# Altium schematic sheet nrf51x22_qfac_dcdc.SchDoc: nRF51x22-QFAC Reference Layout (DCDC)
size A4; Revision: 1.0; SheetNumber: 1; SheetTotal: 1; DrawnBy: RUBR; DocumentSize: A4; PCAName: nRF51x22-QFAC Reference Layout (DCDC)
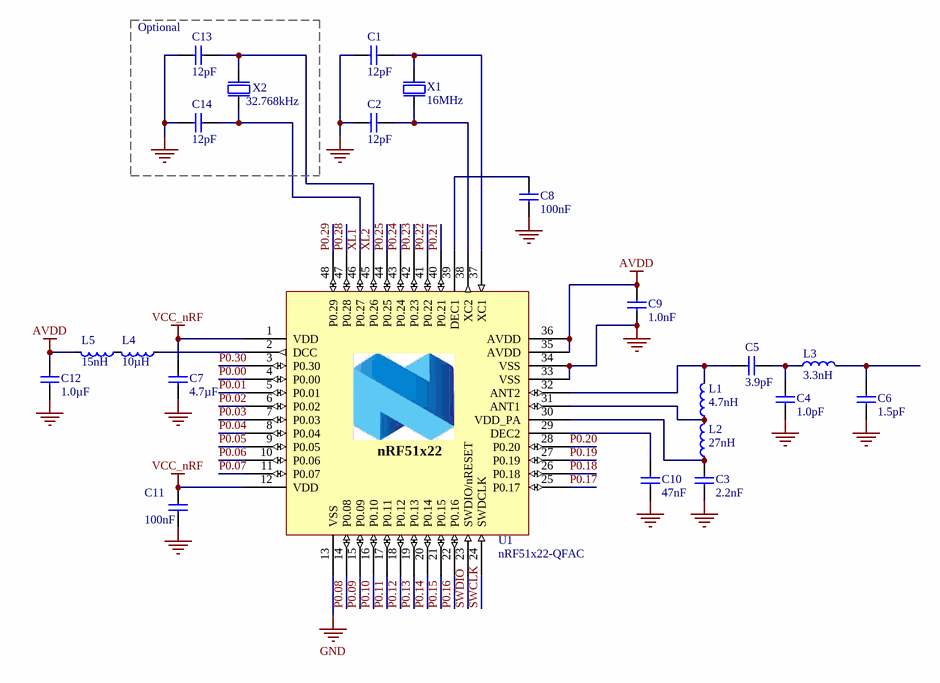
[diagram p0: nrf51x22_qfac_dcdc.SchDoc]

## Parts
C1  12pF  [CAPC1005X04L]
C2  12pF  [CAPC1005X04L]
C3  2.2nF  [CAPC1005X04L]
C4  1.0pF  [CAPC1005X04L]
C5  3.9pF  [CAPC1005X04L]
C6  1.5pF  [CAPC1005X04L]
C7  4.7µF  [CAPC1608X06L]
C8  100nF  [CAPC1005X04L]
C9  1.0nF  [CAPC1005X04L]
C10  47nF  [CAPC1005X04L]
C11  100nF  [CAPC1005X04L]
C12  1.0µF  [CAPC1608X06L]
C13  12pF  [CAPC1005X04L]
C14  12pF  [CAPC1005X04L]
L1  4.7nH  [INDC1005X04L]
L2  27nH  [INDC1005X04L]
L3  3.3nH  [INDC1005X04L]
L4  10µH  [INDC1608X06L]
L5  15nH  [INDC1005X04L]
U1  nRF51x22-QFAC  [QFN40P600X600X90-48N]
X1  16MHz  [BT-XTAL_2520]
X2  32.768kHz  [XTAL_3215]

## Blocks framed on the sheet
Optional: C13 C14 X2

## Nets
AVDD: C9.1 C12.2 L5.2 U1.35(AVDD) U1.36(AVDD)
GND: C1.2 C2.2 C3.2 C4.2 C6.2 C7.2 C8.2 C9.2 C10.2 C11.2 C12.1 C13.1 C14.1 U1.13(VSS) U1.33(VSS) U1.34(VSS) U1.49 X1.2(GND) X1.4(GND)
VCC_nRF: C7.1 C11.1 U1.1(VDD) U1.12(VDD)
P0.00: U1.4(P0.00)
P0.01: U1.5(P0.01)
P0.02: U1.6(P0.02)
P0.03: U1.7(P0.03)
P0.04: U1.8(P0.04)
P0.05: U1.9(P0.05)
P0.06: U1.10(P0.06)
P0.07: U1.11(P0.07)
P0.08: U1.14(P0.08)
P0.09: U1.15(P0.09)
P0.10: U1.16(P0.10)
P0.11: U1.17(P0.11)
P0.12: U1.18(P0.12)
P0.13: U1.19(P0.13)
P0.14: U1.20(P0.14)
P0.15: U1.21(P0.15)
P0.16: U1.22(P0.16)
P0.17: U1.25(P0.17)
P0.18: U1.26(P0.18)
P0.19: U1.27(P0.19)
P0.20: U1.28(P0.20)
P0.21: U1.40(P0.21)
P0.22: U1.41(P0.22)
P0.23: U1.42(P0.23)
P0.24: U1.43(P0.24)
P0.25: U1.44(P0.25)
P0.28: U1.47(P0.28)
P0.29: U1.48(P0.29)
P0.30: U1.3(P0.30)
SWCLK: U1.24(SWDCLK)
SWDIO: U1.23(SWDIO/nRESET)
XL1: C14.2 U1.46(P0.27) X2.2(out)
XL2: C13.2 U1.45(P0.26) X2.1(inp)
NetC1_1: C1.1 U1.37(XC1) X1.1(inp)
NetC2_1: C2.1 U1.38(XC2) X1.3(out)
NetC3_1: C3.1 L2.1 U1.30(VDD_PA)
NetC4_1: C4.1 C5.2 L3.1
NetC5_1: C5.1 L1.2 U1.32(ANT2)
NetC6_1: C6.1 L3.2
NetC8_1: C8.1 U1.39(DEC1)
NetC10_1: C10.1 U1.29(DEC2)
NetL1_1: L1.1 L2.2 U1.31(ANT1)
NetL4_1: L4.1 U1.2(DCC)
NetL4_2: L4.2 L5.1

## Notes on the sheet
- Title
- Size
- Date:
- Project Number
- Sheet         of
- Revision
- File:
- Drawn By:
- (in symbol nRF51x22-QFAC) nRF51x22

## Library data of the parts
C1 C2 C13 C14 = C0402-12p: Capacitor, NP0, ±2%; Note: 50V; Artikkelnr Noca: 20029159; Artikkelnr Simpro: N.A.; Part Number: C0402-12p; Manufacturer: *; Manufacturer Part Number: *; Datasheet: *; LatestRevisionDate: 2011-05-11; Pin Count: 2; Publisher: Nordic Semiconductor; Published: 2009-05-08; Value: 12pF; Supplier: *; Supplier part number: *; 2nd source Supplier: *; 2nd source part number: *; Footprint Doc: 0402
C3 = C0402-2n2: Capacitor, X7R, ±10%; Note: 50V; Artikkelnr Noca: 20039221; Artikkelnr Simpro: N.A.; Part Number: C0402-2n2; Manufacturer: *; Manufacturer Part Number: *; Datasheet: *; LatestRevisionDate: 2009-11-23; Pin Count: 2; Publisher: Nordic Semiconductor; Published: 2009-05-08; Value: 2.2nF; Supplier: *; Supplier part number: *; 2nd source Supplier: *; 2nd source part number: *; Footprint Doc: 0402
C4 = C0402-1.0p: Capacitor, NP0, ±0.1pF; Note: 50V; Artikkelnr Noca: 20029140; Artikkelnr Simpro: N.A.; Part Number: C0402-1.0p; Manufacturer: *; Manufacturer Part Number: *; Datasheet: *; LatestRevisionDate: 2009-11-23; Pin Count: 2; Publisher: Nordic Semiconductor; Published: 2009-05-08; Value: 1.0pF; Supplier: *; Supplier part number: *; 2nd source Supplier: *; 2nd source part number: *; Footprint Doc: 0402
C5 = C0402-3.9p: Capacitor, NP0, ±0.1pF; Note: 50V; Artikkelnr Noca: N.A.; Part Number: C0402-3.9p; Manufacturer: *; Manufacturer Part Number: *; Datasheet: *; LatestRevisionDate: 2014-09-17; Pin Count: 2; Publisher: Nordic Semiconductor; Published: 2009-05-08; Value: 3.9pF; Supplier: *; Supplier part number: *; 2nd source Supplier: *; 2nd source part number: *; Footprint Doc: 0402; Artikkelnr Simpro: N.A.
C6 = C0402-1.5p: Capacitor, NP0, ±0.1pF; Note: 50V; Artikkelnr Noca: 20029139; Artikkelnr Simpro: N.A.; Part Number: C0402-1.5p; Manufacturer: *; Manufacturer Part Number: *; Datasheet: *; LatestRevisionDate: 2009-11-23; Pin Count: 2; Publisher: Nordic Semiconductor; Published: 2009-05-08; Value: 1.5pF; Supplier: *; Supplier part number: *; 2nd source Supplier: *; 2nd source part number: *; Footprint Doc: 0402
C7 = C0603-4µ7: Capacitor, X5R, ±10%; Note: 6.3V; Artikkelnr Noca: 20069060; Artikkelnr Simpro: N.A.; Part Number: C0603-4µ7; Manufacturer: *; Manufacturer Part Number: *; Datasheet: *; LatestRevisionDate: 2009-11-23; Pin Count: 2; Publisher: Nordic Semiconductor; Published: 2009-05-08; Value: 4.7µF; Supplier: *; Supplier part number: *; 2nd source Supplier: *; 2nd source part number: *; Footprint Doc: 0603
C8 C11 = C0402-100n: Capacitor, X7R, ±10%; Note: 16V; Artikkelnr Noca: 20039200; Artikkelnr Simpro: N.A.; Part Number: C0402-100n; Manufacturer: *; Manufacturer Part Number: *; Datasheet: *; LatestRevisionDate: 2009-11-23; Pin Count: 2; Publisher: Nordic Semiconductor; Published: 2009-05-08; Value: 100nF; Supplier: *; Supplier part number: *; 2nd source Supplier: *; 2nd source part number: *; Footprint Doc: 0402
C9 = C0402-1n0: Capacitor, X7R, ±10%; Note: 50V; Artikkelnr Noca: 20039223; Artikkelnr Simpro: N.A.; Part Number: C0402-1n0; Manufacturer: *; Manufacturer Part Number: *; Datasheet: *; LatestRevisionDate: 2009-11-23; Pin Count: 2; Publisher: Nordic Semiconductor; Published: 2009-05-08; Value: 1.0nF; Supplier: *; Supplier part number: *; 2nd source Supplier: *; 2nd source part number: *; Footprint Doc: 0402
C10 = C0402-47n: Capacitor, X7R, ±10%; Note: Chip Cap 10%; Artikkelnr Noca: 20039389; Artikkelnr Simpro: N.A.; Part Number: C0402-47n; Manufacturer: *; Manufacturer Part Number: *; Datasheet: *; LatestRevisionDate: 2009-05-08; Pin Count: 2; Publisher: Nordic Semiconductor; Published: 2009-05-08; Value: 47nF; Supplier: *; Supplier part number: *; 2nd source Supplier: *; 2nd source part number: *; Footprint Doc: 0402
C12 = C0603-1µ0: Capacitor, X7R, ±10%; Note: 16V; Artikkelnr Noca: 20039335; Artikkelnr Simpro: N.A.; Part Number: C0603-1µ0; Manufacturer: *; Manufacturer Part Number: *; Datasheet: *; LatestRevisionDate: 2013-06-05; Pin Count: 2; Publisher: Nordic Semiconductor; Published: 2009-05-08; Value: 1.0µF; Supplier: *; Supplier part number: *; 2nd source Supplier: *; 2nd source part number: *; Footprint Doc: 0603
L1 = L0402-4n7: High frequency chip inductor ±5%; Manufacturer: Murata; Manufacturer Part Number: LQP15MN4N7B02D; Artikkelnr Noca: 33029164; Artikkelnr Simpro: N.A.; Part Number: L0402-4n7; Datasheet: http://search.murata.co.jp/Ceramy/image/img/PDF/ENG/L0075S0084LQP15M.pdf; LatestRevisionDate: 2012-09-19; Pin Count: 2; Publisher: Nordic Semiconductor; Published: 2009-05-08; Value: 4.7nH; Note: High frequency chip inductor ±5%; Supplier: Digi-Key; Supplier part number: 490-1132-1-ND; 2nd source Supplier: *; 2nd source part number: *; Footprint Doc: 0402
L2 = L0402-27n: High frequency chip inductor ±5%; Manufacturer: Murata; Manufacturer Part Number: LQP15MN27NG02D; Note: High frequency chip inductor ±2%; Artikkelnr Noca: N.A.; Part Number: L0402-27n; Datasheet: http://search.murata.co.jp/Ceramy/image/img/PDF/ENG/L0075S0084LQP15M.pdf; LatestRevisionDate: 2014-09-17; Pin Count: 2; Publisher: Nordic Semiconductor; Published: 2014-06-12; Value: 27nH; Supplier: Digi-Key; Supplier part number: 490-6751-1-ND; 2nd source Supplier: *; 2nd source part number: *; Footprint Doc: 0402; Artikkelnr Simpro: N.A.
L3 = L0402-3n3: High frequency chip inductor ±5%; Manufacturer: Murata; Manufacturer Part Number: LQP15MN3N3B02D; Artikkelnr Noca: 33029369; Artikkelnr Simpro: N.A.; Part Number: L0402-3n3; Datasheet: http://search.murata.co.jp/Ceramy/image/img/PDF/ENG/L0075S0084LQP15M.pdf; LatestRevisionDate: 2012-09-19; Pin Count: 2; Publisher: Nordic Semiconductor; Published: 2009-05-08; Value: 3.3nH; Note: High frequency chip inductor ±5%; Supplier: Digi-Key; Supplier part number: 490-1130-1-ND; 2nd source Supplier: *; 2nd source part number: *; Footprint Doc: 0402
L4 = L0603-10µ: Chip inductor, IDC,min = 50 mA, ±20%; Manufacturer: Taiyo Yuden; Manufacturer Part Number: LBMF1608T100K; 2nd source part number: 178-6105; Note: LBMF1608T100K 10µH 80mA 0603; Artikkelnr Noca: 33029314; Artikkelnr Simpro: N.A.; Part Number: L0603-10µ; Datasheet: http://www.yuden.co.jp/ut/product/pdf/elb2_e.pdf; LatestRevisionDate: 2012-09-19; Pin Count: 2; Publisher: Nordic Semiconductor; Published: 2010-02-24; Value: 10µH; Supplier: Digi-Key; Supplier part number: 587-1714-1-ND; 2nd source Supplier: Farnell; Footprint Doc: 0603
L5 = L0402-15n: High frequency chip inductor ±10%; Manufacturer: Taiyo Yuden; Manufacturer Part Number: HK100515NJ-T; 2nd source part number: 658-1328; Artikkelnr Noca: 33029323; Artikkelnr Simpro: N.A.; Part Number: L0402-15n; LatestRevisionDate: 2012-09-19; Pin Count: 2; Publisher: Nordic Semiconductor; Published: 2010-07-12; Value: 15nH; Note: High frequency chip inductor ±10%; Supplier: Digi-Key; Datasheet: http://www.yuden.co.jp/productdata/catalog/en/mlci04_e.pdf; Supplier part number: 587-1521-1-ND; 2nd source Supplier: Farnell; Footprint Doc: 0402
U1 = nRF51x22-QFAC: Multi-protocol Bluetooth Low Energy, ANT and 2.4GHz proprietary system-on-chip; Manufacturer: Nordic Semiconductor; Note: nRF51422 - QFN48 6x6 0.4mm pitch; Artikkelnr Noca: N.A.; Part Number: nRF51x22-QFAC; Manufacturer Part Number: nRF51x22-QFAC; Datasheet: *; LatestRevisionDate: 2014-09-24; Pin Count: 48; Publisher: Nordic Semiconductor; Published: 2014-09-24; Value: nRF51x22-QFAC; Supplier: Nordic Semiconductor; Supplier part number: *; 2nd source Supplier: *; 2nd source part number: *; Footprint Doc: QFN-48; Artikkelnr Simpro: N.A.
X1 = NX2520SA-16MHZ-STD-CSW-5: XTAL SMD 2520, 16MHz, 8pF, ±40ppm; Manufacturer: NDK; Note: XTAL SMD 16.000MHz; Artikkelnr Noca: 22019192; Artikkelnr Simpro: N.A.; Part Number: NX2520SA-16MHZ-STD-CSW-5; Manufacturer Part Number: NX2520SA-16MHZ-STD-CSW-5; Datasheet: http://www.ndk.com/images/products/catalog/c_NX2520SA-STD-CSW-5_e.pdf; LatestRevisionDate: 2012-06-15; Pin Count: 4; Publisher: Nordic Semiconductor; Published: 2012-06-15; Value: 16MHz; Supplier: Digi-Key; Supplier part number: 644-1169-1-ND; 2nd source Supplier: *; 2nd source part number: *; Footprint Doc: BT-XTAL_2520
X2 = XTAL_FC-135 32.768k: XTAL SMD 3215, 32.768kHz, 9pF, ±20ppm; Manufacturer: Epson Toyocom; Manufacturer Part Number: FC-135 32.768KHZ ±20PPM,9.0PF; 2nd source part number: 127-8037; Note: XTAL SMD 32.768kHz, 3215; Artikkelnr Noca: 22019091; Artikkelnr Simpro: N.A.; Part Number: XTAL_FC-135 32.768k; Datasheet: http://www.farnell.com/datasheets/57480.pdf; LatestRevisionDate: 2014-03-27; Pin Count: 2; Publisher: Nordic Semiconductor; Published: 2010-10-18; Value: 32.768kHz; Supplier: Digi-Key; Supplier part number: FC-135 32.7680KA-AC-ND; 2nd source Supplier: Farnell; Footprint Doc: XTAL_3215